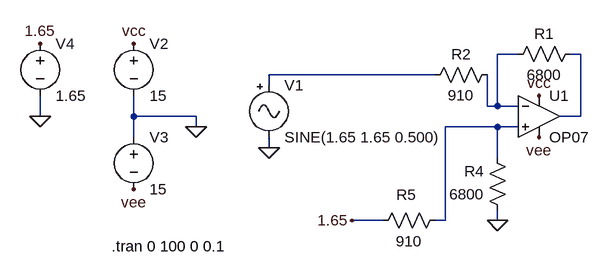
[diagram p0: schematic restador.asc]
restador.asc, the LTspice schematic file:
Version 4
SHEET 1 880 680
WIRE 128 48 96 48
WIRE 224 48 208 48
WIRE 0 80 -256 80
WIRE -256 96 -256 80
WIRE 80 128 80 80
WIRE 96 128 96 48
WIRE 96 128 80 128
WIRE 128 128 96 128
WIRE -608 144 -608 112
WIRE -464 144 -464 112
WIRE -368 144 -464 144
WIRE 224 144 224 48
WIRE 224 144 192 144
WIRE -368 160 -368 144
WIRE 96 160 16 160
WIRE 128 160 96 160
WIRE -464 176 -464 144
WIRE -256 192 -256 176
WIRE 96 208 96 160
WIRE -80 304 -128 304
WIRE 16 304 16 160
WIRE 16 304 0 304
WIRE 96 304 96 288
FLAG 160 112 vcc
FLAG 160 176 vee
FLAG -128 304 1.65
FLAG -256 192 0
FLAG 96 304 0
FLAG -368 160 0
FLAG -464 32 vcc
FLAG -464 256 vee
FLAG -608 32 1.65
FLAG -608 144 0
SYMBOL OpAmps\\OP07 160 80 R0
SYMATTR InstName U1
SYMBOL res 224 32 R90
WINDOW 0 0 56 VBottom 2
WINDOW 3 32 56 VTop 2
SYMATTR InstName R1
SYMATTR Value 6800
SYMBOL res 96 64 R90
WINDOW 0 0 56 VBottom 2
WINDOW 3 32 56 VTop 2
SYMATTR InstName R2
SYMATTR Value 910
SYMBOL res 112 304 R180
WINDOW 0 36 76 Left 2
WINDOW 3 36 40 Left 2
SYMATTR InstName R4
SYMATTR Value 6800
SYMBOL res -96 320 R270
WINDOW 0 40 52 VTop 2
WINDOW 3 0 56 VBottom 2
SYMATTR InstName R5
SYMATTR Value 910
SYMBOL Misc\\signal -256 80 R0
WINDOW 123 0 0 Left 0
WINDOW 39 0 0 Left 0
SYMATTR InstName V1
SYMATTR Value SINE(1.65 1.65 0.500)
SYMBOL voltage -464 16 R0
WINDOW 123 0 0 Left 0
WINDOW 39 0 0 Left 0
SYMATTR InstName V2
SYMATTR Value 15
SYMBOL voltage -464 160 R0
WINDOW 123 0 0 Left 0
WINDOW 39 0 0 Left 0
SYMATTR InstName V3
SYMATTR Value 15
SYMBOL voltage -608 16 R0
WINDOW 123 0 0 Left 0
WINDOW 39 0 0 Left 0
SYMATTR InstName V4
SYMATTR Value 1.65
TEXT -498 344 Left 2 !.tran 0 100 0 0.1

The netlist it stands for:
* restador.asc
XU1 N004 N001 vcc vee N002 LT1001  ; OP07, pins In+ In- V+ V- OUT
R1 N002 N001 6800
R2 N001 N003 910
R4 0 N004 6800
R5 1.65 N004 910
V1 N003 0 SINE(1.65 1.65 0.500)
V2 vcc 0 15
V3 0 vee 15
V4 1.65 0 1.65
.tran 0 100 0 0.1
.lib LTC.lib
.backanno
.end